# Altium schematic sheet JacdacBrainRP2040 59.SchDoc: complete design
size A3; DocumentNumber: 1; SheetNumber: 1; SheetTotal: 1; VersionControl_RevNumber: 1
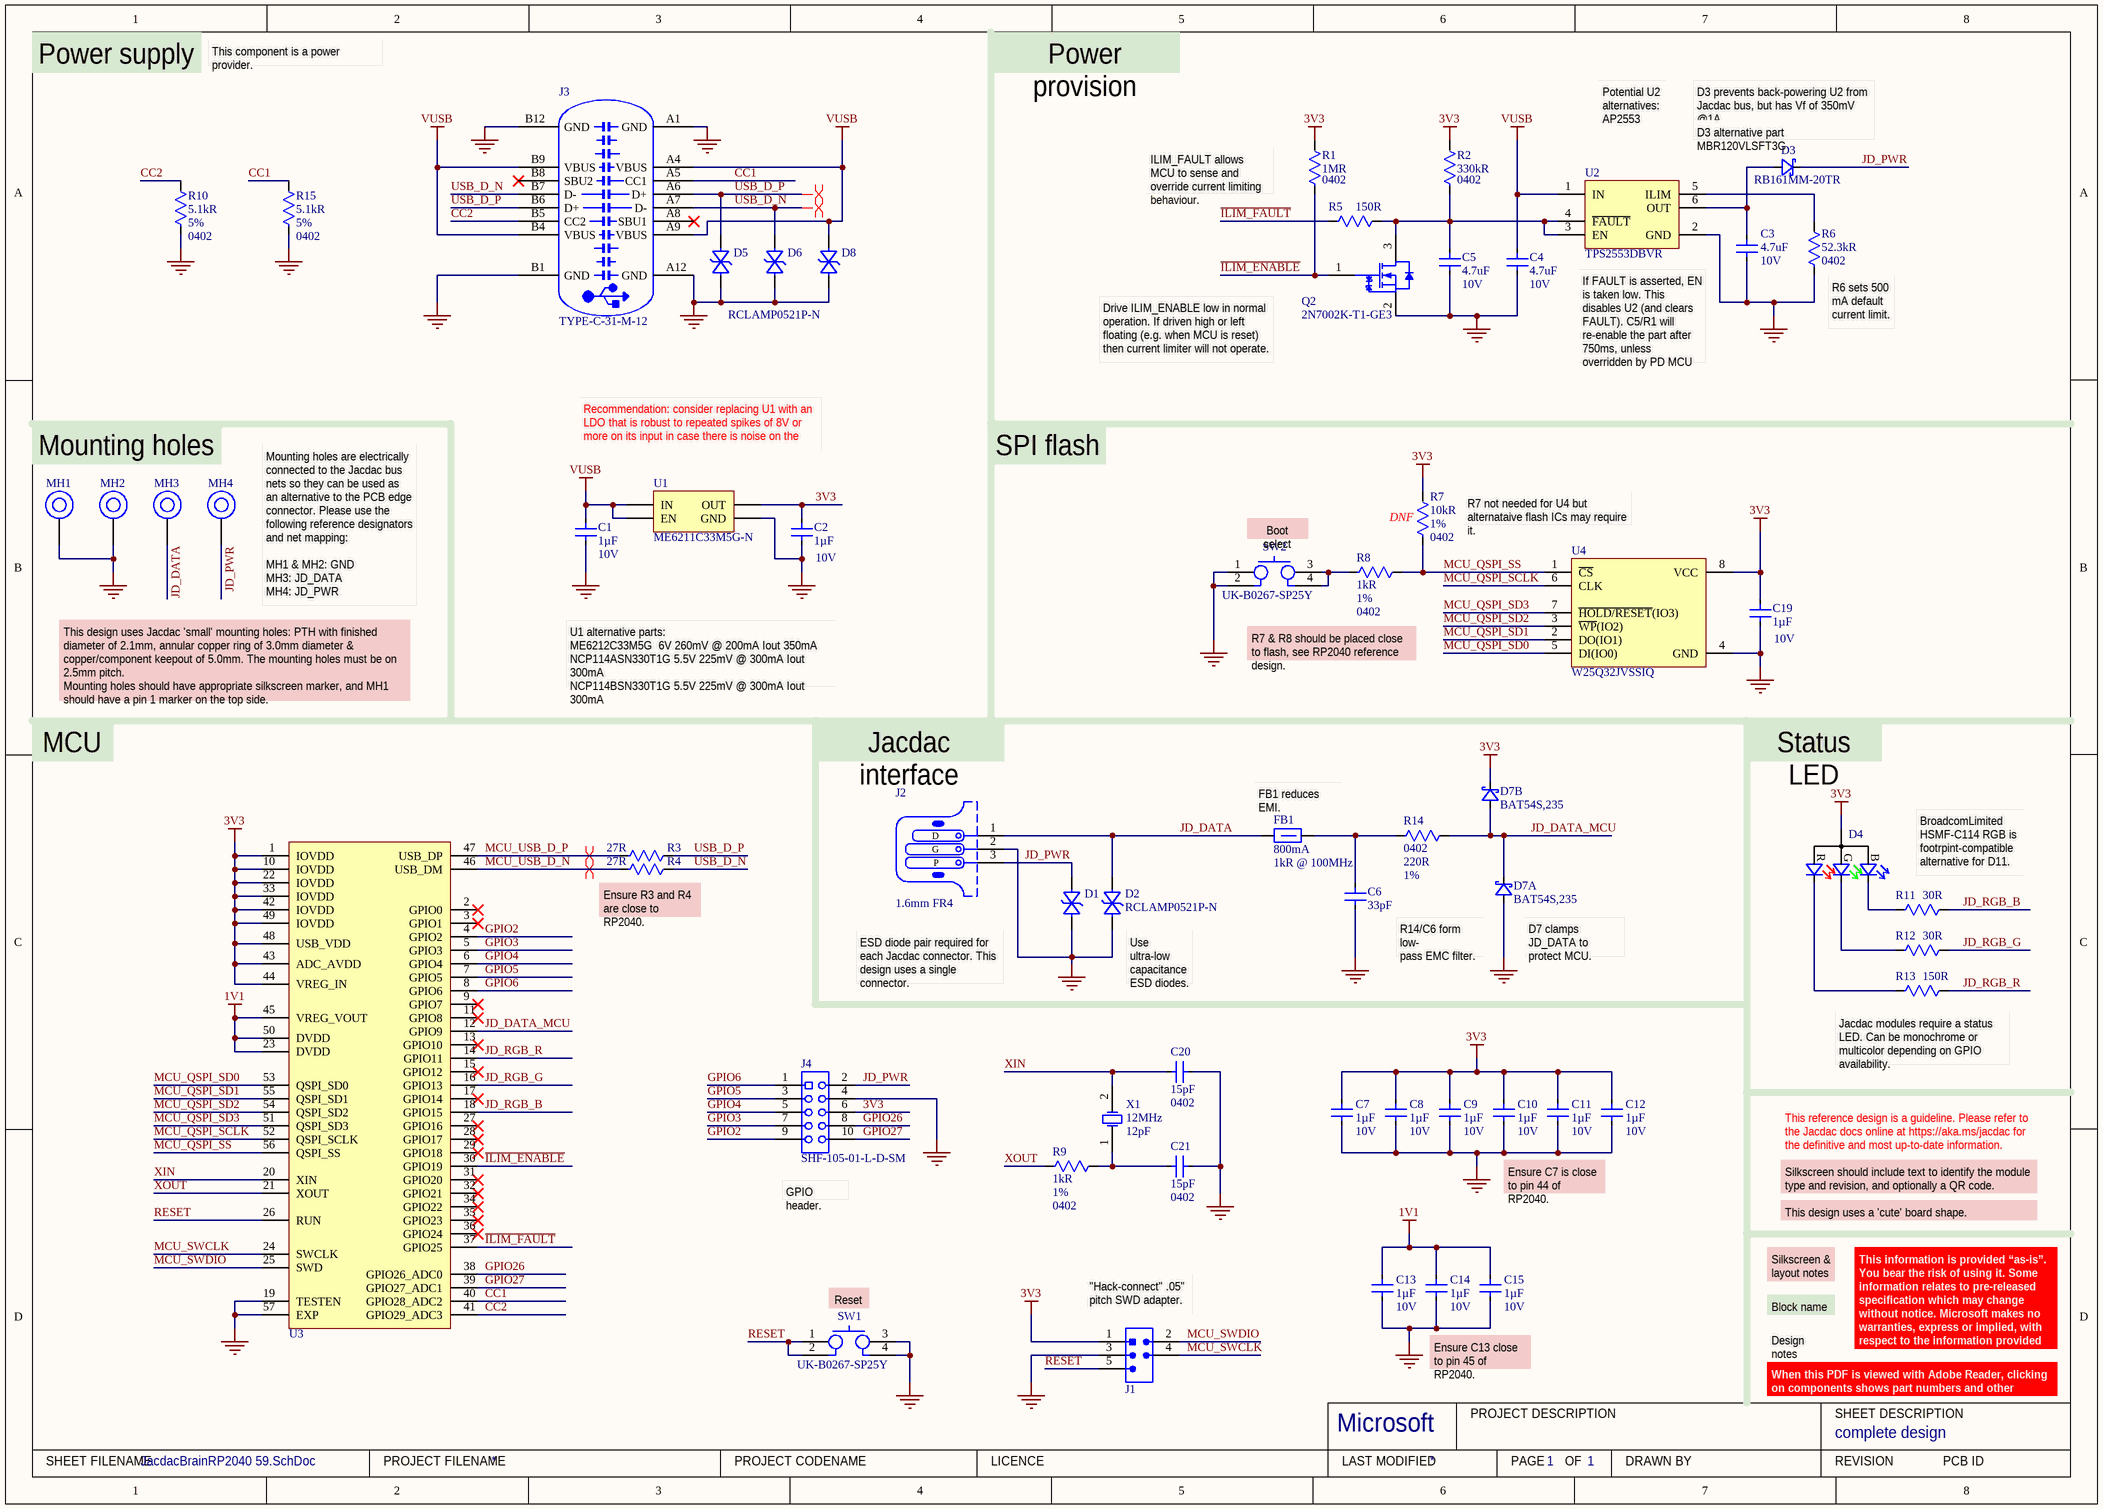
[diagram p0: JacdacBrainRP2040 59.SchDoc]

## Parts
C1  Capacitance: 1µF  Voltage Rating: 10V  [C0402_0.55MM - without outline]  (hidden comment: CL05A105KP5NNNC)
C2  Capacitance: 1µF  Voltage Rating: 10V  [C0402_0.55MM - without outline]  (hidden comment: CL05A105KP5NNNC)
C3  Capacitance: 4.7uF  Voltage Rating: 10V  [R0402 - Without outline]  (hidden comment: CL05A475MP5NRNC)
C4  Capacitance: 4.7uF  Voltage Rating: 10V  [R0402 - Without outline]  (hidden comment: CL05A475MP5NRNC)
C5  Capacitance: 4.7uF  Voltage Rating: 10V  [R0402 - Without outline]  (hidden comment: CL05A475MP5NRNC)
C6  Capacitance: 33pF  [C0402_0.55MM - without outline]  (hidden comment: CL05C330JB51PNC)
C7  Capacitance: 1µF  Voltage Rating: 10V  [C0402_0.55MM - without outline]  (hidden comment: CL05A105KP5NNNC)
C8  Capacitance: 1µF  Voltage Rating: 10V  [C0402_0.55MM - without outline]  (hidden comment: CL05A105KP5NNNC)
C9  Capacitance: 1µF  Voltage Rating: 10V  [C0402_0.55MM - without outline]  (hidden comment: CL05A105KP5NNNC)
C10  Capacitance: 1µF  Voltage Rating: 10V  [C0402_0.55MM - without outline]  (hidden comment: CL05A105KP5NNNC)
C11  Capacitance: 1µF  Voltage Rating: 10V  [C0402_0.55MM - without outline]  (hidden comment: CL05A105KP5NNNC)
C12  Capacitance: 1µF  Voltage Rating: 10V  [C0402_0.55MM - without outline]  (hidden comment: CL05A105KP5NNNC)
C13  Capacitance: 1µF  Voltage Rating: 10V  [C0402_0.55MM - without outline]  (hidden comment: CL05A105KP5NNNC)
C14  Capacitance: 1µF  Voltage Rating: 10V  [C0402_0.55MM - without outline]  (hidden comment: CL05A105KP5NNNC)
C15  Capacitance: 1µF  Voltage Rating: 10V  [C0402_0.55MM - without outline]  (hidden comment: CL05A105KP5NNNC)
C19  Capacitance: 1µF  Voltage Rating: 10V  [C0402_0.55MM - without outline]  (hidden comment: CL05A105KP5NNNC)
C20  Capacitance: 15pF  Case/Package: 0402  [C0402_0.55MM - without outline]  (hidden comment: CL05C150JB5NNNC)
C21  Capacitance: 15pF  Case/Package: 0402  [C0402_0.55MM - without outline]  (hidden comment: CL05C150JB5NNNC)
D1  RCLAMP0521P-N  [TVS 0402 - L]  (value not drawn)
D2  RCLAMP0521P-N  [TVS 0402 - L]
D3  RB161MM-20TR  [SOD-123F]
D4  TZ-P4-1615RGBTCA1-0.55T  [TZ-P4-1615RGBTCA1-0.55T]  (value not drawn)
D5  RCLAMP0521P-N  [TVS 0402 - L]  (value not drawn)
D6  RCLAMP0521P-N  [TVS 0402 - L]  (value not drawn)
D7  Manufacturer Part Number: BAT54S,235  [NXP-BAT54S-TO-236AB - without outline]  (hidden comment: BAT54S)  (parts A,B of 2)
D8  RCLAMP0521P-N  [TVS 0402 - L]
FB1  Current Rating: 800mA  Impedance: 1kR @ 100MHz  [TDK MPZ1608 0.8mm - without outline]  (hidden comment: TDK MPZ1608S102ATA00)
J1  Hack Connect Mini 1.27 mm pitch 2-row  [HACK_CONNECT_MINI_5_X_1_27]  (value not drawn)  (no BOM)
J2  PCB Type: 1.6mm FR4  [JACDAC_EDGE_CONNECTOR_NO_TRACES]  (hidden comment: 3 pin JACDAC edge connector)  (no BOM)
J3  TYPE-C-31-M-12  [TYPE-C-31-M-12]
J4  Manufacturer Part Number: SHF-105-01-L-D-SM  [Samtec SHF-105-01-L-D-SM - NO SILKSCREEN]  (hidden comment: SHF-105-01-L-D-SM-whitesch)
MH1  MH_5.0MMK_3.0MMC_2.1MMD_PTH  [MH_5.0MMK_3.0MMC_2.1MMD_PTH]  (value not drawn)  (no BOM)
MH2  MH_5.0MMK_3.0MMC_2.1MMD_PTH  [MH_5.0MMK_3.0MMC_2.1MMD_PTH]  (value not drawn)  (no BOM)
MH3  MH_5.0MMK_3.0MMC_2.1MMD_PTH  [MH_5.0MMK_3.0MMC_2.1MMD_PTH]  (value not drawn)  (no BOM)
MH4  MH_5.0MMK_3.0MMC_2.1MMD_PTH  [MH_5.0MMK_3.0MMC_2.1MMD_PTH]  (value not drawn)  (no BOM)
Q2  2N7002K-T1-GE3  [SOT-23-3 (TO-236)]
R1  Resistance: 1MR  Case Code (Imperial): 0402  [R0402 - Without outline]
R2  Resistance: 330kR  Size Code: 0402  [R0402 - Without outline]  (hidden comment: RC0402FR-07330KL)
R3  Resistance: 27R  [R0402 - Without outline]  (hidden comment: RC0402FR-0727RL)
R4  Resistance: 27R  [R0402 - Without outline]  (hidden comment: RC0402FR-0727RL)
R5  Resistance: 150R  [R0402 - Without outline]  (hidden comment: RC0402FR-07150RL)
R6  Resistance: 52.3kR  Case Code (Imperial): 0402  [R0402 - Without outline]  (hidden comment: RC0402FR-0752K3L)
R7  Resistance: 10kR  Tolerance: 1%  Case Code (Imperial): 0402  [R0402 - Without outline]  (hidden comment: 10k)
R8  Resistance: 1kR  Tolerance: 1%  Case Code (Imperial): 0402  [R0402 - Without outline]  (hidden comment: RC0402FR-071KL)
R9  Resistance: 1kR  Tolerance: 1%  Case Code (Imperial): 0402  [R0402 - Without outline]  (hidden comment: RC0402FR-071KL)
R10  Resistance: 5.1kR  Tolerance: 5%  Case Code (Imperial): 0402  [R0402 - Without outline]  (hidden comment: RC0402JR-075K1L)
R11  Resistance: 30R  [R0402 - Without outline]  (hidden comment: RC0402FR-0730RL)
R12  Resistance: 30R  [R0402 - Without outline]  (hidden comment: RC0402FR-0730RL)
R13  Resistance: 150R  [R0402 - Without outline]  (hidden comment: RC0402FR-07150RL)
R14  Case Code (Imperial): 0402  Resistance: 220R  Tolerance: 1%  [R0402 - Without outline]  (hidden comment: RC0402FR-07220RL)
R15  Resistance: 5.1kR  Tolerance: 5%  Case Code (Imperial): 0402  [R0402 - Without outline]  (hidden comment: RC0402JR-075K1L)
SW1  UK-B0267-SP25Y  [USAKRO-UK-B0267-SP25Y]
SW2  UK-B0267-SP25Y  [USAKRO-UK-B0267-SP25Y]
U1  ME6211C33M5G-N  [MICRONE-SOT23-5]
U2  TPS2553DBVR  [TI-TPS2553 - without_outline]
U3  RP2040  [RP2040]  (value not drawn)
U4  (no value)  [8-SOIC]
X1  12MHz  Load Capacitance: 12pF  [SMD-5032_2P]

## Nets
1V1: C13.2 C14.2 C15.2 U3.23(DVDD) U3.45(VREG_VOUT) U3.50(DVDD)
3V3: C2.2 C7.2 C8.2 C9.2 C10.2 C11.2 C12.2 C19.2 D4.1(A) D7.2(K) J1.1(VCC) J4.6 R1.1 R2.1 R7.1 U1.5(OUT) U3.1(IOVDD) U3.10(IOVDD) U3.22(IOVDD) U3.33(IOVDD) U3.42(IOVDD) U3.43(ADC_AVDD) U3.44(VREG_IN) U3.48(USB_VDD) U3.49(IOVDD) U4.8(VCC)
GND: C1.1 C2.1 C3.1 C4.1 C5.1 C6.1 C7.1 C8.1 C9.1 C10.1 C11.1 C12.1 C13.1 C14.1 C15.1 C19.1 C20.2 C21.2 D1.2(A) D2.2(A) D5.2(A) D6.2(A) D7.1(A) D8.2(A) J1.3(GND) J2.2(G) J3.A1(GND) J3.A12(GND) J3.B1(GND) J3.B12(GND) J4.4 MH1.1 MH2.1 Q2.2(S) R6.1 R10.2 R15.2 SW1.3 SW1.4 SW2.1 SW2.2 U1.2(GND) U2.2(GND) U3.19(TESTEN) U3.57(EXP) U4.4(GND)
VUSB: C1.2 C4.2 D8.1(K) J3.A4(VBUS) J3.A9(VBUS) J3.B4(VBUS) J3.B9(VBUS) U1.1(IN) U1.3(EN) U2.1(IN)
~{ILIM_ENABLE}: Q2.1(G) R1.2 U3.30(GPIO19)
~{ILIM_FAULT}: R5.1 U3.37(GPIO25)
CC1: J3.A5(CC1) R15.1 U3.40(GPIO28_ADC2)
CC2: J3.B5(CC2) R10.1 U3.41(GPIO29_ADC3)
GPIO2: J4.9 U3.4(GPIO2)
GPIO3: J4.7 U3.5(GPIO3)
GPIO4: J4.5 U3.6(GPIO4)
GPIO5: J4.3 U3.7(GPIO5)
GPIO6: J4.1 U3.8(GPIO6)
GPIO26: J4.8 U3.38(GPIO26_ADC0)
GPIO27: J4.10 U3.39(GPIO27_ADC1)
JD_DATA: D2.1(K) FB1.1 J2.1(D) MH3.1
JD_DATA_MCU: D7.3(K) R14.1 U3.12(GPIO9)
JD_PWR: D1.1(K) D3.1(K) J2.3(P) J4.2 MH4.1
JD_RGB_B: R11.2 U3.18(GPIO15)
JD_RGB_G: R12.2 U3.16(GPIO13)
JD_RGB_R: R13.2 U3.14(GPIO11)
MCU_QSPI_SCLK: U3.52(QSPI_SCLK) U4.6(CLK)
MCU_QSPI_SD0: U3.53(QSPI_SD0) U4.5(DI(IO0))
MCU_QSPI_SD1: U3.55(QSPI_SD1) U4.2(DO(IO1))
MCU_QSPI_SD2: U3.54(QSPI_SD2) U4.3(~{WP}(IO2))
MCU_QSPI_SD3: U3.51(QSPI_SD3) U4.7(~{HOLD/RESET}(IO3))
MCU_QSPI_SS: R7.2 R8.1 U3.56(QSPI_SS) U4.1(~{CS})
MCU_SWCLK: J1.4(SWCLK) U3.24(SWCLK)
MCU_SWDIO: J1.2(SWDIO) U3.25(SWD)
MCU_USB_D_N: R4.1 U3.46(USB_DM)
MCU_USB_D_P: R3.1 U3.47(USB_DP)
RESET: J1.5(RESET) SW1.1 SW1.2 U3.26(RUN)
USB_D_N: D6.1(K) J3.A7(D-) J3.B7(D-) R4.2
USB_D_P: D5.1(K) J3.A6(D+) J3.B6(D+) R3.2
XIN: C20.1 U3.20(XIN) X1.2(OSC2/OSC1)
XOUT: R9.2 U3.21(XOUT)
NetC3_2: C3.2 D3.2(A) U2.6(OUT)
NetC5_2: C5.2 Q2.3(D) R2.2 R5.2 U2.3(EN) U2.4(~{FAULT})
NetC6_2: C6.2 FB1.2 R14.2
NetC21_1: C21.1 R9.1 X1.1(OSC1/OSC2)
NetD4_2: D4.2(R) R13.1
NetD4_3: D4.3(G) R12.1
NetD4_4: D4.4(B) R11.1
NetR6_2: R6.2 U2.5(ILIM)
NetR8_2: R8.2 SW2.3 SW2.4

Not connected (* = marked no-connect by the designer): J3 A8(SBU1)* B8(SBU2)*; U3 2(GPIO0)* 3(GPIO1)* 9(GPIO7)* 11(GPIO8)* 13(GPIO10)* 15(GPIO12)* 17(GPIO14)* 27(GPIO16)* 28(GPIO17)* 29(GPIO18)* 31(GPIO20)* 32(GPIO21)* 34(GPIO22)* 35(GPIO23)* 36(GPIO24)*

## Layout directives
differential pair: MCU_USB_D_N, MCU_USB_D_P, USB_D_N, USB_D_P

## Notes on the sheet
- Power supply
- This component is a power provider.
- Power provision
- Potential U2 alternatives:
  AP2553
- (near D3) D3 prevents back-powering U2 from Jacdac bus, but has Vf of 350mV @1A.
- (near D3) D3 alternative part MBR120VLSFT3G
- (near R1) ILIM_FAULT allows MCU to sense and override current limiting behaviour.
- Drive ILIM_ENABLE low in normal operation. If driven high or left floating (e.g. when MCU is reset) then current limiter will not operate.
- If FAULT is asserted, EN is taken low. This disables U2 (and clears FAULT). C5/R1 will re-enable the part after 750ms, unless overridden by PD MCU
- (near R6) R6 sets 500 mA default current limit.
- Recommendation: consider replacing U1 with an LDO that is robust to repeated spikes of 8V or more on its input in case there is noise on the Jacdac bus.
- Mounting holes
- SPI flash
- (near MH4) Mounting holes are electrically connected to the Jacdac bus nets so they can be used as an alternative to the PCB edge connector. Please use the following reference designators and net mapping:
- (near SW2) Boot select
- (near R7) DNF
- R7 not needed for U4 but alternataive flash ICs may require it.
- (near MH4) MH1 & MH2: GND
  MH3: JD_DATA
  MH4: JD_PWR
- This design uses Jacdac 'small' mounting holes: PTH with finished diameter of 2.1mm, annular copper ring of 3.0mm diameter & copper/component keepout of 5.0mm. The mounting holes must be on 2.5mm pitch.
  Mounting holes should have appropriate silkscreen marker, and MH1 should have a pin 1 marker on the top side.
- U1 alternative parts:
  ME6212C33M5G  6V 260mV @ 200mA Iout 350mA
  NCP114ASN330T1G 5.5V 225mV @ 300mA Iout 300mA
  NCP114BSN330T1G 5.5V 225mV @ 300mA Iout 300mA
- R7 & R8 should be placed close to flash, see RP2040 reference design.
- MCU
- Jacdac interface
- Status LED
- (near FB1) FB1 reduces EMI.
- (near R4) Ensure R3 and R4 are close to RP2040.
- BroadcomLimited HSMF-C114 RGB is footrpint-compatible alternative for D11.
- ESD diode pair required for each Jacdac connector. This design uses a single connector.
- (near D2) Use ultra-low capacitance ESD diodes.
- R14/C6 form low-
  pass EMC filter.
- (near D7) D7 clamps JD_DATA to protect MCU.
- (near R13) Jacdac modules require a status LED. Can be monochrome or multicolor depending on GPIO availability.
- Ensure C7 is close to pin 44 of RP2040.
- Silkscreen should include text to identify the module type and revision, and optionally a QR code.
- This reference design is a guideline. Please refer to the Jacdac docs online at https://aka.ms/jacdac for the definitive and most up-to-date information.
- (near J4) GPIO header.
- This design uses a 'cute' board shape.
- (near SW1) Reset
- (near J1) "Hack-connect" .05" pitch SWD adapter.
- Block name
- Silkscreen & layout notes
- Ensure C13 close to pin 45 of RP2040.
- Design notes
- When this PDF is viewed with Adobe Reader, clicking on components shows part numbers and other details.
- This information is provided “as-is”. You bear the risk of using it. Some information relates to pre-released specification which may change without notice. Microsoft makes no warranties, express or implied, with respect to the information provided here.
- Microsoft
- PROJECT DESCRIPTION
- SHEET DESCRIPTION
- SHEET FILENAME
- PROJECT FILENAME
- PROJECT CODENAME
- LICENCE
- LAST MODIFIED
- PAGE
- OF
- DRAWN BY
- REVISION
- PCB ID

## Library data of the parts
C1 C2 C7-C15 C19 = CL05A105KP5NNNC: CAP CER 1UF 10V X5R 0402; Manufacturer: Samsung; Material: Ceramic; Tolerance: 10%; Supplier 1: Digi-Key; Manufacturer Part Number: CL05A105KP5NNNC; RoHS: Yes; Category: Capacitors; Stock 1: 5705569; Pricing 1: 1=0.10000, 10=0.03900, 50=0.02100, 100=0.01720, 500=0.01228, 1000=0.00965, 2500=0.00877, 5000=0.00807 (USD); Mount: Surface Mount; Case/Package: 0402; Case Code (Metric): 1005; Contact Plating: Tin; Min Operating Temperature: -55°C; Max Operating Temperature: 85°C; Dielectric: X5R; Package Quantity: 1; Packaging: Tape and Reel; Length: 1mm; Height: 0.5mm; Width: 0.02inch; Thickness: 0.022inch; Depth: 0.5mm; Radiation Hardening: No; ComponentLink1URL: https://datasheet.ciiva.com/15195/getdatasheetpartid-358390-15195630.pdf; ComponentLink1Description: Online datasheet; Supplier 2: Mouser; Stock 2: 928941; Pricing 2: 1=0.10000, 10=0.04200, 100=0.01800, 500=0.01300, 1000=0.01000, 2500=0.00900 (USD); Supplier 3: Farnell; Stock 3: 53670; Pricing 3: 10=0.02450, 100=0.02000, 500=0.01310, 2500=0.00920, 5000=0.00810, 10000=0.00640, 50000=0.00490 (GBP); Supplier Part Number 3: 3013329; Supplier Part Number 2: 187-CL05A105KP5NNNC; Supplier Part Number 1: 1276-1076-1-ND; Created: DG; Checked: ?; Case Code (Imperial): 0402
C3-C5 = CL05A475MP5NRNC: CAP CER 4.7UF 10V X5R 0402; Manufacturer: Samsung; Tolerance: 20%; Supplier 1: Digi-Key; Manufacturer Part Number: CL05A475MP5NRNC; RoHS: Yes; Category: Ceramic Capacitors; Stock 1: 840000; Pricing 1: 10000=0.01405, 20000=0.01338 (USD); Mount: Surface Mount; Case/Package: 0402; Case Code (Metric): 1005; Min Operating Temperature: -55°C; Max Operating Temperature: 85°C; Package Quantity: 10000; Packaging: Tape and Reel; Dielectric: X5R; Series: CL; Length: 0.039inch; Width: 0.02inch; Thickness: 0.022inch; Lead Free: Lead Free; RoHS Compliant: Yes; ComponentLink1URL: https://datasheet.ciiva.com/25786/cl05a475mp5nrnc-25786963.pdf; ComponentLink1Description: Online datasheet; Supplier 2: Future Electronics; Stock 2: 2004; Pricing 2: 1=0.23500, 500=0.03970, 1500=0.02900, 2500=0.02500, 5000=0.02050 (USD); Created By: D. Gakure; Checked By: ?; Supplier Part Number 2: 2103694; Supplier Part Number 1: 1276-1482-2-ND; Case Code (Imperial): 0402
C6 = CL05C330JB51PNC: CAP CER 33PF 50V NP0 0402; Manufacturer: Samsung; Tolerance: 5%; Supplier 1: Digi-Key; Manufacturer Part Number: CL05C330JB51PNC; RoHS: Yes; Category: Capacitors; Stock 1: 250654; Pricing 1: 1=0.10000, 10=0.07500, 50=0.04060, 100=0.03320, 500=0.02374, 1000=0.01865, 2500=0.01696, 5000=0.01560 (USD); Mount: Surface Mount; Case/Package: 0402; Case Code (Metric): 1005; Min Operating Temperature: -55°C; Max Operating Temperature: 125°C; Packaging: Tape and Reel; Length: 0.039inch; Width: 0.02inch; Thickness: 0.022inch; Ratings: AEC-Q200; Lead Free: Lead Free; ComponentLink1URL: http://www.samsungsem.com/kr/support/library/product-catalog/mlcc.jsp; ComponentLink1Description: Samsung datasheet online; Supplier 2: Mouser; Stock 2: 97900; Pricing 2: 1=0.11000, 10=0.08200, 100=0.03600, 500=0.02600, 1000=0.02000, 2500=0.01800 (USD); Supplier 3: Future Electronics; Stock 3: 100000; Pricing 3: 10000=0.00780 (USD); Supplier Part Number 3: 6022520; Supplier Part Number 2: 187-CL05C330JB51PNC; Checked: ?; Created: DG; Supplier Part Number 1: 1276-6515-1-ND; Voltage Rating: 50V; Case Code (Imperial): 0402
C20 C21 = CL05C150JB5NNNC: CAP CER 15PF 50V C0G/NP0 0402; Manufacturer: Samsung; Material: Ceramic; Tolerance: 5%; Dielectric: C0G; Temperature Coefficient: 300ppm/°C; Supplier 1: Digi-Key; Manufacturer Part Number: CL05C150JB5NNNC; RoHS: Yes; Category: Ceramic Capacitors; Stock 1: 822355; Pricing 1: 1=0.10000, 10=0.02600, 50=0.01440, 100=0.01180, 500=0.00842, 1000=0.00661, 2500=0.00601, 5000=0.00553 (USD); Mount: Surface Mount; Case Code (Metric): 1005; Contact Plating: Tin; Min Operating Temperature: -55°C; Max Operating Temperature: 125°C; Package Quantity: 1; Packaging: Tape and Reel; Voltage Rating: 50V; Voltage: 50V; Series: CL; Construction: Flat; Length: 1mm; Width: 0.02inch; Height: 0.5mm; Thickness: 0.022inch; Depth: 0.5mm; Radiation Hardening: No; RoHS Compliant: Yes; ComponentLink1URL: https://datasheet.ciiva.com/15195/getdatasheetpartid-497170-15195669.pdf; ComponentLink1Description: Online datasheet; Supplier 2: Mouser; Stock 2: 313617; Pricing 2: 1=0.10000, 10=0.01400, 50=0.01400, 100=0.01200, 1000=0.00700, 10000=0.00500 (USD); Supplier Part Number 2: 187-CL05C150JB5NNNC; Supplier Part Number 1: 1276-1179-1-ND; Case Code (Imperial): 0402
D1 D2 D5 D6 D8 = RCLAMP0521P-N: Bidirectional 5V (Max) 6V 16V 3.5A (8/20us) 0402 TVS RoHS; Manufacturer: Born Semiconductor; Package: 0402; Created By: D Gakure; Checked By: ?; Supplier1: LCSC; Supplier1 Part Number: C316043; ComponentLink1Description: Online datasheet; ComponentLink1URL: https://datasheet.lcsc.com/szlcsc/Bourne-Semicon-Shenzhen-RCLAMP0521P-N_C316043.pdf; Manufacturer Part Number: RCLAMP0521P-N
D3 = RB161MM-20TR: ROHM - RB161MM-20TR - Schottky-Gleichrichterdiode, 20 V, 1 A, Einfach, SOD-123FL, 2 Pin(s), 350 mV; Average Rectified Current: 1A; Max Reverse Voltage (DC): 25V; Supplier 1: Digi-Key; Manufacturer: Rohm; RoHS: Yes; Category: Rectifier Diodes; Pricing 1: 3000=0.09900, 6000=0.09350, 15000=0.08525, 30000=0.07975, 75000=0.07500 (USD); Mount: Surface Mount; Case/Package: SOD; Number of Pins: 2; Max Operating Temperature: 125°C; Packaging: Tape and Reel; RoHS Compliant: Yes; ComponentLink1URL: http://www.mouser.com/ds/2/348/rb161mm-20tr-e-1138856.pdf; ComponentLink1Description: Online datasheet; Supplier 2: RSComponents; Stock 2: 1; Pricing 2: 30=0.29200, 150=0.15800, 300=0.15300, 750=0.14900, 1500=0.14500 (USD); Supplier 3: Mouser; Pricing 3: 1=0.33000, 10=0.25100, 50=0.25100, 100=0.12500, 1000=0.10000, 10000=0.07600 (USD); Supplier Part Number 2: 1246775; Supplier Part Number 1: RB161MM-20TR-ND; Supplier Part Number 3: 755-RB161MM-20TR; Manufacturer Part Number: RB161MM-20TR
D4 = TZ-P4-1615RGBTCA1-0.55T: 1615 Light Emitting Diodes (LED) RoHS; Manufacturer: TUOZHAN; Manufacturer Part Number: TZ-P4-1615RGBTCA1-0.55T; Category: Optoelectronics; Package: 1615; ComponentLink1Description: Online datasheet; ComponentLink1URL: https://datasheet.lcsc.com/szlcsc/2009041238_TUOZHAN-TZ-P4-1615RGBTCA1-0-55T_C779813.pdf; RoHS: RoHS Compliant; Supplier 1: LCSC; Size / Dimension: 1.6x1.5mm; Supplier 1 Part Number: C779813; Packaging: Tape & Reel (TR); Created By: D. Gakure; Checked By: ?
D7 = BAT54S: DIODE ARRAY SCHOTTKY 30V SOT23; Manufacturer: Nexperia; Supplier 1: Digi-Key; RoHS: No; Category: Rectifier Diodes; Stock 1: 14011; Pricing 1: 1=0.13000, 10=0.11900, 100=0.05610, 500=0.03326, 1000=0.02185, 5000=0.02138 (USD); ComponentLink1URL: https://assets.nexperia.com/documents/data-sheet/BAT54_SER.pdf; ComponentLink1Description: NXP datasheet online; Supplier 2: Mouser; Supplier 3: RSComponents; Supplier Part Number 2: 771-BAT54S235; Supplier Part Number 3: 1707990; Supplier Part Number 1: 1727-1868-1-ND
FB1 = TDK MPZ1608S102ATA00: 0603 1k@100MHz 0.8A chip; Core Material: Ferrite; Tolerance: 25%; DC Resistance (DCR): 300mR; Supplier 1: Digi-Key; Stock 1: 113542; Pricing 1: 1=0.1, 10=0.079, 25=0.0716, 50=0.0644, 100=0.0472, 250=0.03432, 500=0.03146, 1000=0.02717 (USD); Mount: Surface Mount; Case/Package: 0603; Case Code (Metric): 1608; Case Code (Imperial): 0603; Package Quantity: 4000; Packaging: Tape and Reel; Max DC Current: 800mA; Length: 0.063inch; Height: 0.037inch; Width: 0.031inch; ComponentLink2URL: https://www.mouser.co.uk/datasheet/2/400/eads_commercial_power_mpz1608_en-923650.pdf; ComponentLink2Description: datasheet online; Supplier 2: Mouser; ComponentLink3Description: datasheet; ComponentLink3URL: Y:\System\Altium\Libraries 2014\TDK\Datasheets\eads_commercial_power_mpz1608_en-923650.pdf; Supplier Part Number 1: 445-8694-1-ND; Supplier Part Number 2: 810-MPZ1608S102ATA00; Manufacturer: TDK; Manufacturer Part Number: MPZ1608S102ATA00
J1 = HACK_CONNECT_MINI
J2 = Jacdac edge connector: 3 pin Jacdac edge connector 1.27mm pitch; Manufacturer Part Number: JACDAC_EDGE_CONNECTOR; Checked By: ?; Created By: D. Gakure; ComponentLink1Description: Yuliang JACDAC cable connector drawing online; ComponentLink1URL: https://github.com/microsoft/jacdac-mdk/blob/main/connector/JACDAC-Connector-by-Yuliang-2020-11-28.pdf; ComponentLink2Description: JACDAC PCB edge connector spec onlin; ComponentLink2URL: https://github.com/microsoft/jacdac-mdk/blob/main/connector/JACDAC_PCB_Edge_Connector_Drawing_JD-PEC-01_rev_01.pdf
J3 = TYPE-C-31-M-12: USB - Type C Female 16 USB Connectors RoHS; Manufacturer: Korean Hroparts Elec; Gender: Receptacle; Number of Positions: 16; RoHS: Yes; Category: USB Connectors; Orientation: Right Angle; ComponentLink1URL: https://datasheet.lcsc.com/szlcsc/1811131825_Korean-Hroparts-Elec-TYPE-C-31-M-12_C165948.pdf; ComponentLink1Description: Online datasheet; Supplier 1 Part Number: C165948; Supplier 1: LCSC; Manufacturer Part Number: TYPE-C-31-M-12
J4 = SHF-105-01-L-D-SM-whitesch: Standard Card Edge Connectors .050 Mini Edge Card Connector, Vertical; Manufacturer: Samtec; Number of Contacts: 10; Gender: Male; Pitch: 1.27mm; Supplier 1: Samtec; Supplier Part Number 1: SHF-105-01-L-D-SM; ComponentLink1Description: samtec datasheet online; ComponentLink1URL: http://www.farnell.com/datasheets/1927736.pdf?src-supplier=Avnet; ComponentLink2Description: samtec datasheet; ComponentLink2URL: Y:\System\Altium\Libraries 2014\Samtec; Supplier 2: Digi-Key; Stock 2: 9740; Pricing 2: 1=2.98, 45=2.618, 135=2.38, 540=2.023, 1035=1.7255, 5040=1.547 (USD); Contact Plating: Gold; Contact Material: Bronze; Housing Color: Black; Housing Material: Polymer; Min Operating Temperature: -55°C; Max Operating Temperature: 125°C; Packaging: Bulk; Number of Rows: 2; Termination: Solder; Orientation: Straight; Length: 12.7mm; Depth: 5.59mm; Radiation Hardening: No; REACH SVHC: No SVHC; Supplier 3: Farnell; Supplier 4: Mouser; Supplier 5: RSComponents; Supplier Part Number 2: SAM10710-ND; Supplier Part Number 3: 1885915; Supplier Part Number 4: 200-SHF10501LDSM; Supplier Part Number 5: 9011854; Supplier 6: Digi-Key; RoHS: Yes; Category: Card Edge Connectors; Stock 6: 49; Pricing 6: 1=4.53000, 10=4.34400, 25=3.98200, 50=3.80100, 100=3.62000, 250=3.16752, 500=3.07700, 1000=2.62450, 2500=2.44350 (USD); Mount: Surface Mount; ComponentLink3URL: https://datasheet.ciiva.com/10926/mecf-10926311.pdf?src-supplier=Avnet; ComponentLink3Description: https://datasheet.ciiva.com/10926/mecf-10926311.pdf?src-supplier=Avnet; ComponentLink4URL: https://datasheet.ciiva.com/16666/mecf-16666423.pdf?src-supplier=Avnet+Europe; ComponentLink4Description: https://datasheet.ciiva.com/16666/mecf-16666423.pdf?src-supplier=Avnet+Europe; Supplier Part Number 6: SAM11496-ND
MH1-MH4 = MH_5.0MMK_3.0MMC_2.1MMD_PTH: Mounting Hole 5.0mm keepout, 3.0mm annualar ring and 2.1mm Drill PTH
Q2 = 2N7002K-T1-GE3: Trans MOSFET N-CH Si 60V 0.3A 3-Pin SOT-23 T/R; Manufacturer: Vishay; Rds On Max: 2R; Input Capacitance: 30pF; Max Power Dissipation: 350mW; Continuous Drain Current (ID): 300mA; Element Configuration: Single; Nominal Vgs: 2V; Number of Elements: 1; Gate to Source Voltage (Vgs): 20V; Turn-Off Delay Time: 35ns; Threshold Voltage: 1V; Turn-On Delay Time: 25ns; Supplier 1: Digi-Key; RoHS: Yes; Category: MOSFETs; Pricing 1: 1=0.27000, 10=0.21800, 25=0.18200, 100=0.11540, 500=0.07590, 1000=0.05161 (USD); Mount: Surface Mount; Case/Package: SOT-23; Number of Pins: 3; Contact Plating: Tin,Matte; Weight: 0.050717oz; Min Operating Temperature: -55°C; Max Operating Temperature: 150°C; Packaging: Tape and Reel; Drain to Source Voltage (Vdss): 60V; On-State Resistance: 2R; Voltage: 60V; Package Quantity: 1; Number of Channels: 1; Drain to Source Breakdown Voltage: 60V; Drain to Source Resistance: 2R; Power Dissipation: 350mW; Length: 3.04mm; Width: 1.4mm; Height: 1.02mm; Radiation Hardening: No; Lead Free: Lead Free; REACH SVHC: Unknown; ComponentLink1URL: https://datasheet.ciiva.com/2957/2n7002k-2957216.pdf; ComponentLink1Description: Online datasheet; Supplier 2: RSComponents; Stock 2: 1; Pricing 2: 100=0.11100 (USD); Supplier Part Number 1: 2N7002K-T1-GE3CT-ND; Supplier Part Number 2: 7879058P; Manufacturer Part Number: 2N7002K-T1-GE3
R1 = RC0402FR-071ML: RES SMD 1M OHM 1% 1/16W 0402; Manufacturer: Yageo; Power Rating: 63mW; Voltage Rating: 50V; Temperature Coefficient: 100ppm/°C; Supplier 1: Digi-Key; Manufacturer Part Number: RC0402FR-071ML; RoHS: Yes; Category: Chip SMD Resistors; Stock 1: 7856490; Pricing 1: 1=0.10000, 10=0.01600, 100=0.00640, 1000=0.00286, 2500=0.00248, 5000=0.00205 (USD); Case/Package: 0402; Case Code (Metric): 1005; Size Code: 0402; Min Operating Temperature: -55°C; Max Operating Temperature: 155°C; Resistor Type: Thick Film; Packaging: Tape and Reel; Termination: SMD/SMT; Features: Moisture Resistant; Series: RC; Max Power Dissipation: 63mW; Number of Terminations: 2; Resistance Tolerance: 1%; Construction: Rectangular; Technology: THICK FILM; Length: 1mm; Height: 0.32mm; Depth: 0.5mm; RoHS Compliant: Yes; REACH SVHC: Unknown; Military Standard: Not; Lead Free: Lead Free; ComponentLink1URL: https://datasheet.ciiva.com/11808/0900766b80c66297-11808125.pdf; ComponentLink1Description: Online datasheet; Supplier 2: Mouser; Stock 2: 1194490; Pricing 2: 1=0.10000, 10=0.01200, 50=0.01200, 100=0.00400, 1000=0.00400, 10000=0.00300 (USD); Supplier 3: Farnell; Stock 3: 1530000; Pricing 3: 10000=0.00290, 50000=0.00200 (GBP); Created By: D. Gakure; Supplier Part Number 2: 603-RC0402FR-071ML; Supplier Part Number 1: 311-1.00MLRCT-ND; Checked By: ?; Supplier Part Number 3: 2421892; Tolerance: 1%
R2 = RC0402FR-07330KL: RES SMD 330K OHM 1% 1/16W 0402; Manufacturer: Yageo; Power Rating: 63mW; Voltage Rating: 50V; Temperature Coefficient: 100ppm/°C; Supplier 1: Digi-Key; Manufacturer Part Number: RC0402FR-07330KL; RoHS: Yes; Category: Chip SMD Resistors; Stock 1: 78809; Pricing 1: 1=0.10000, 10=0.01600, 100=0.00660, 1000=0.00299, 2500=0.00259, 5000=0.00214 (USD); Case/Package: 0402; Case Code (Metric): 1005; Case Code (Imperial): 0402; Min Operating Temperature: -55°C; Max Operating Temperature: 155°C; Package Quantity: 1; Packaging: Tape and Reel; Resistor Type: Thick Film; Number of Terminations: 2; Termination: SMD/SMT; Max Power Dissipation: 63mW; Features: Moisture Resistant; Series: RC; Resistance Tolerance: 1%; Construction: Rectangular; Length: 1mm; Width: 0.02inch; Height: 0.016inch; Depth: 0.5mm; REACH SVHC: Unknown; Military Standard: Not; Lead Free: Lead Free; RoHS Compliant: Yes; ComponentLink1URL: https://datasheet.ciiva.com/2518/pyu-r-int-thick-7-2518994.pdf?src-supplier=Digi-Key; ComponentLink1Description: Online datasheet; Supplier 2: Mouser; Stock 2: 218637; Pricing 2: 1=0.10000, 10=0.01400, 50=0.01400, 100=0.00500, 1000=0.00300, 10000=0.00200 (USD); Supplier 3: Farnell; Stock 3: 310234; Pricing 3: 10=0.01210, 100=0.00460, 500=0.00410, 2500=0.00310, 5000=0.00280, 10000=0.00250, 50000=0.00180 (GBP); Supplier Part Number 2: 603-RC0402FR-07330KL; Supplier Part Number 1: 311-330KLRCT-ND; Supplier Part Number 3: 9239537; Created By: D Gakure; Tolerance: 1%; Checked By: ?
R3 R4 = RC0402FR-0727RL: RES SMD 27 OHM 1% 1/16W 0402; Manufacturer: Yageo; Power Rating: 62.5mW; Voltage Rating: 50V; Temperature Coefficient: 100ppm/°C; Max Power Dissipation: 63mW; Supplier 1: Digi-Key; Manufacturer Part Number: RC0402FR-0727RL; RoHS: Yes; Category: Chip SMD Resistors; Pricing 1: 1=0.10000, 10=0.01600, 100=0.00660, 1000=0.00299, 2500=0.00259, 5000=0.00214 (USD); Case/Package: 0402; Case Code (Metric): 1005; Weight: 2.3E-05oz; Size Code: 0402; Min Operating Temperature: -55°C; Max Operating Temperature: 155°C; Tolerance: 1%; Packaging: Tape and Reel; Resistor Type: Thick Film; Termination: SMD/SMT; Number of Terminations: 2; Features: Moisture Resistant; Series: RC; Construction: Rectangular; Technology: THICK FILM; Resistance Tolerance: 1%; Length: 1mm; Width: 0.5mm; Height: 0.016inch; Depth: 0.5mm; REACH SVHC: Unknown; Military Standard: Not; Lead Free: Lead Free; RoHS Compliant: Yes; ComponentLink1URL: https://datasheet.ciiva.com/11808/0900766b80c66297-11808450.pdf; ComponentLink1Description: Online datasheeet; Supplier 2: Farnell; Stock 2: 29644; Pricing 2: 10=0.01720, 100=0.00650, 500=0.00560, 2500=0.00380, 5000=0.00370, 10000=0.00350, 50000=0.00240 (GBP); Supplier 3: Future Electronics; Stock 3: 450000; Pricing 3: 10000=0.00130, 50000=0.00090, 200000=0.00090, 400000=0.00090, 1000000=0.00080 (USD); Supplier Part Number 3: 2577120; Supplier Part Number 2: 9239049; Supplier Part Number 1: YAG3086CT-ND; Case Code (Imperial): 0402
R5 R13 = RC0402FR-07150RL: RES SMD 150 OHM 1% 1/16W 0402; Manufacturer: Yageo; Power Rating: 62.5mW; Voltage Rating: 50V; Temperature Coefficient: 100ppm/°C; Max Power Dissipation: 63mW; Supplier 1: Digi-Key; Manufacturer Part Number: RC0402FR-07150RL; RoHS: Yes; Category: Chip SMD Resistors; Stock 1: 5214533; Pricing 1: 1=0.10000, 10=0.01400, 100=0.00580, 1000=0.00260, 2500=0.00226, 5000=0.00186 (USD); Case/Package: 0402; Case Code (Metric): 1005; Min Operating Temperature: -55°C; Max Operating Temperature: 155°C; Packaging: Tape and Reel; Package Quantity: 1; Resistor Type: Thick Film; Number of Terminations: 2; Termination: SMD/SMT; Working Voltage: 50V; Features: Moisture Resistant; Series: RC; Resistance Tolerance: 1%; Construction: Rectangular; Technology: THICK FILM; Length: 1mm; Width: 0.02inch; Height: 0.016inch; Depth: 0.5mm; REACH SVHC: No SVHC; Military Standard: Not; Lead Free: Lead Free; RoHS Compliant: Yes; ComponentLink1URL: https://datasheet.ciiva.com/11808/0900766b80c66297-11808422.pdf; ComponentLink1Description: ine datasheet; Supplier 2: Mouser; Stock 2: 582717; Pricing 2: 1=0.10000, 10=0.01200, 50=0.01200, 100=0.00400, 1000=0.00400, 10000=0.00300 (USD); Supplier 3: Farnell; Stock 3: 880000; Pricing 3: 10000=0.00270, 50000=0.00200 (GBP); Created by: D. Gakure; Checked By: ?; Supplier Part Number 3: 2421893; Supplier Part Number 2: 603-RC0402FR-07150RL; Supplier Part Number 1: 311-150LRCT-ND; Tolerance: 1%; Case Code (Imperial): 0402
R6 = RC0402FR-0752K3L: RES SMD 52.3K OHM 1% 1/16W 0402; Manufacturer: Yageo; Temperature Coefficient: 100ppm/°C; Power Rating: 62.5mW; Voltage Rating: 50V; Max Power Dissipation: 63mW; Supplier 1: Digi-Key; Manufacturer Part Number: RC0402FR-0752K3L; RoHS: Yes; Category: Chip SMD Resistors; Stock 1: 1178310; Pricing 1: 1=0.10000, 10=0.01600, 100=0.00640, 1000=0.00286, 2500=0.00248, 5000=0.00205 (USD); Case/Package: 0402; Contact Plating: Tin,Matte; Weight: 2.3E-05oz; Min Operating Temperature: -55°C; Max Operating Temperature: 155°C; Resistor Type: Thick Film; Packaging: Tape and Reel; Number of Terminations: 2; Termination: SMD/SMT; Voltage Rating (DC): 50V; Features: Moisture Resistant; Series: RC; Construction: Rectangular; Length: 1mm; Width: 0.02inch; Height: 0.016inch; Depth: 0.5mm; Military Standard: Not; Lead Free: Lead Free; RoHS Compliant: Yes; ComponentLink1URL: https://datasheet.ciiva.com/16867/pyu-rc0402-51-rohs-l-6-16867930.pdf; ComponentLink1Description: Oline datasheet; Supplier 2: Mouser; Stock 2: 83620; Pricing 2: 1=0.10000, 10=0.01200, 50=0.01200, 100=0.00400, 1000=0.00300, 10000=0.00300 (USD); Created By: D. Gakure; Checked By: ?; Supplier Part Number 2: 603-RC0402FR-0752K3L; Supplier Part Number 1: YAG3179CT-ND; Size Code: 0402; Case Code (Metric): 1005; Tolerance: 1%
R7 = RC0402FR-0710KL: RES SMD 10K OHM 1% 1/16W 0402; Manufacturer: Yageo; Temperature Coefficient: 100ppm/°C; Voltage Rating (DC): 50V; Power Rating: 62.5mW; Supplier 1: Digi-Key; Manufacturer Part Number: RC0402FR-0710KL; RoHS: Yes; Category: Resistors; Stock 1: 40173593; Pricing 1: 1=0.10000, 10=0.01400, 100=0.00580, 1000=0.00262, 2500=0.00228, 5000=0.00188 (USD); Case/Package: 0402; Number of Pins: 2; Case Code (Metric): 1005; Min Operating Temperature: -55°C; Max Operating Temperature: 155°C; Resistor Type: Thick Film; Packaging: Tape and Reel; Voltage Rating: 50V; Termination: SMD/SMT; Working Voltage: 50V; Number of Terminations: 2; Length: 1mm; Height: 0.32mm; Width: 0.5mm; Depth: 0.5mm; Lead Pitch: 0.2mm; REACH SVHC: No SVHC; Lead Free: Lead Free; Military Standard: Not; ComponentLink3URL: https://datasheet.ciiva.com/7849/1686128-7849814.pdf; ComponentLink3Description: Online datasheet; Supplier 2: Mouser; Stock 2: 23672167; Pricing 2: 1=0.10000, 10=0.01300, 100=0.00400, 1000=0.00300, 2500=0.00300, 10000=0.00200 (USD); Supplier 3: Farnell; Stock 3: 370000; Pricing 3: 10000=0.00350 (GBP); Checked: ?; Created: DG; Supplier Part Number 1: 311-10.0KLRCT-ND; Supplier Part Number 2: 603-RC0402FR-0710KL; Supplier Part Number 3: 2363463
R8 R9 = RC0402FR-071KL: RES SMD 1K OHM 1% 1/16W 0402; Manufacturer: Yageo; Temperature Coefficient: 100ppm/°C; Voltage Rating (DC): 50V; Power Rating: 62.5mW; Supplier 1: Digi-Key; Manufacturer Part Number: RC0402FR-071KL; RoHS: Yes; Category: Resistors; Stock 1: 37591306; Pricing 1: 1=0.10000, 10=0.01400, 100=0.00580, 1000=0.00262, 2500=0.00228, 5000=0.00188 (USD); Case/Package: 0402; Number of Pins: 2; Case Code (Metric): 1005; Min Operating Temperature: -55°C; Max Operating Temperature: 155°C; Resistor Type: Thick Film; Packaging: Tape and Reel; Voltage Rating: 50V; Termination: SMD/SMT; Length: 1mm; Height: 0.32mm; Width: 0.5mm; Depth: 0.5mm; REACH SVHC: Unknown; Lead Free: Lead Free; Military Standard: Not; ComponentLink2URL: https://datasheet.ciiva.com/12666/pyu-rc0402-51-rohs-l-6-r-12666741.pdf; ComponentLink2Description: Online datasheet; Supplier 2: Mouser; Stock 2: 11912978; Pricing 2: 1=0.10000, 10=0.01200, 100=0.00400, 1000=0.00400, 2500=0.00400, 10000=0.00300 (USD); Supplier 3: Farnell; Stock 3: 29900; Pricing 3: 1=0.08130, 25=0.01210, 100=0.01120, 250=0.01030, 500=0.00900 (GBP); Supplier Part Number 3: 2132441; Supplier Part Number 2: 603-RC0402FR-071KL; Supplier Part Number 1: 311-1.00KLRDKR-ND; Created: D.G; Checked: ?
R10 R15 = RC0402JR-075K1L: RES SMD 5.1K OHM 5% 1/16W 0402; Manufacturer: Yageo; Voltage Rating: 50V; Power Rating: 62.5mW; Temperature Coefficient: 100ppm/°C; Max Power Dissipation: 63mW; Supplier 1: Digi-Key; Manufacturer Part Number: RC0402JR-075K1L; RoHS: Yes; Category: Chip SMD Resistors; Stock 1: 1270619; Pricing 1: 1=0.10000, 10=0.01300, 100=0.00520, 1000=0.00233, 2500=0.00202, 5000=0.00167 (USD); Case/Package: 0402; Case Code (Metric): 1005; Weight: 2.3E-05oz; Size Code: 0402; Min Operating Temperature: -55°C; Max Operating Temperature: 155°C; Packaging: Tape and Reel; Resistor Type: Thick Film; Termination: SMD/SMT; Voltage Rating (DC): 50V; Features: Moisture Resistant; Series: RC; Number of Terminations: 2; Construction: Rectangular; Resistance Tolerance: 5%; Length: 1mm; Width: 0.5mm; Height: 0.35mm; Depth: 0.5mm; REACH SVHC: No SVHC; Military Standard: Not; Lead Free: Lead Free; RoHS Compliant: Yes; ComponentLink2URL: https://datasheet.ciiva.com/16740/pyu-rc0402-51-rohs-l-6-r-16740925.pdf; ComponentLink2Description: Onnline datasheet; Supplier 2: Newark; Stock 2: 1265; Pricing 2: 1=0.10000, 25=0.01000, 100=0.00400, 250=0.00400, 500=0.00300, 1000=0.00300 (USD); Supplier 3: Mouser; Stock 3: 100817; Pricing 3: 1=0.10000, 10=0.01000, 50=0.01000, 100=0.00400, 1000=0.00300, 10000=0.00200 (USD); Supplier 4: Farnell; Stock 4: 68890; Pricing 4: 10=0.00910, 100=0.00390, 500=0.00320, 2500=0.00240, 5000=0.00210, 10000=0.00190, 50000=0.00150 (GBP); Supplier 5: Farnell; Stock 5: 1265; Pricing 5: 10000=0.00270 (GBP); Supplier Part Number 5: 1799293; Supplier Part Number 4: 3495714; Supplier Part Number 3: 603-RC0402JR-075K1L; Supplier Part Number 2: 68R0016; Supplier Part Number 1: 311-5.1KJRCT-ND; Created By: D. Gakure; Checked By: ?
R11 R12 = RC0402FR-0730RL: RES SMD 30 OHM 1% 1/16W 0402; Manufacturer: Yageo; Temperature Coefficient: 100ppm/°C; Power Rating: 63mW; Voltage Rating: 50V; Supplier 1: Digi-Key; Manufacturer Part Number: RC0402FR-0730RL; RoHS: Yes; Category: Chip SMD Resistors; Stock 1: 2973; Pricing 1: 1=0.10000, 10=0.01400, 100=0.00580, 1000=0.00260, 2500=0.00226, 5000=0.00186 (USD); Case/Package: 0402; Contact Plating: Tin,Matte; Case Code (Metric): 1005; Size Code: 0402; Min Operating Temperature: -55°C; Max Operating Temperature: 155°C; Resistor Type: Thick Film; Packaging: Tape and Reel; Termination: SMD/SMT; Voltage Rating (DC): 50V; Features: Moisture Resistant; Series: RC; Max Power Dissipation: 63mW; Number of Terminations: 2; Construction: Rectangular; Resistance Tolerance: 1%; Length: 1mm; Width: 0.5mm; Height: 0.35mm; Depth: 0.5mm; REACH SVHC: Unknown; Military Standard: Not; Lead Free: Lead Free; RoHS Compliant: Yes; ComponentLink1URL: https://datasheet.ciiva.com/7849/1018594-7849958.pdf; ComponentLink1Description: Online datasheet; Supplier 2: Mouser; Stock 2: 41804; Pricing 2: 1=0.10000, 10=0.01200, 50=0.01200, 100=0.00400, 1000=0.00400, 10000=0.00300 (USD); Supplier 3: Farnell; Stock 3: 4422; Pricing 3: 10=0.01210, 100=0.00420, 500=0.00370, 2500=0.00280, 5000=0.00250, 10000=0.00230, 50000=0.00150 (GBP); Supplier Part Number 3: 1458775; Supplier Part Number 2: 603-RC0402FR-0730RL; Supplier Part Number 1: 311-30LRCT-ND; Created By: D. Gakure; Checked By: ?; Tolerance: 1%; Case Code (Imperial): 0402
R14 = RC0402FR-07220RL: RES SMD 220 OHM 1% 1/16W 0402; Manufacturer: Yageo; Power Rating: 62.5mW; Voltage Rating: 50V; Temperature Coefficient: 100ppm/°C; Max Power Dissipation: 63mW; Supplier 1: Digi-Key; Manufacturer Part Number: RC0402FR-07220RL; RoHS: Yes; Category: Resistors; Stock 1: 1286042; Pricing 1: 1=0.10000, 10=0.01400, 100=0.00580, 1000=0.00262, 2500=0.00228, 5000=0.00188 (USD); Case/Package: 0402; Number of Pins: 2; Case Code (Metric): 1005; Min Operating Temperature: -55°C; Max Operating Temperature: 155°C; Packaging: Tape and Reel; Voltage Rating (DC): 50V; Package Quantity: 1; Termination: SMD/SMT; Resistor Type: Thick Film; Number of Terminations: 2; Features: Moisture Resistant; Length: 1mm; Height: 0.016inch; Width: 0.02inch; Depth: 0.5mm; REACH SVHC: No SVHC; Military Standard: Not; Lead Free: Lead Free; ComponentLink1URL: https://datasheet.ciiva.com/11819/0900766b80c66297-11819466.pdf?src-supplier=RSComponents; ComponentLink1Description: https://datasheet.ciiva.com/11819/0900766b80c66297-11819466.pdf?src-supplier=RSComponents; ComponentLink2URL: https://datasheet.ciiva.com/2453/pyu-r-int-thick-7-2453460.pdf?src-supplier=Digi-Key; ComponentLink2Description: https://datasheet.ciiva.com/2453/pyu-r-int-thick-7-2453460.pdf?src-supplier=Digi-Key; ComponentLink3URL: https://datasheet.ciiva.com/2453/pyu-r-int-thick-7-2453461.pdf?src-supplier=Digi-Key; ComponentLink3Description: https://datasheet.ciiva.com/2453/pyu-r-int-thick-7-2453461.pdf?src-supplier=Digi-Key; ComponentLink4URL: https://datasheet.ciiva.com/2453/pyu-r-int-thick-7-2453462.pdf?src-supplier=Digi-Key; ComponentLink4Description: https://datasheet.ciiva.com/2453/pyu-r-int-thick-7-2453462.pdf?src-supplier=Digi-Key; ComponentLink5URL: https://datasheet.ciiva.com/16746/pyu-rc0402-51-rohs-l-6-r-16746831.pdf?src-supplier=Future+Electronics; ComponentLink5Description: https://datasheet.ciiva.com/16746/pyu-rc0402-51-rohs-l-6-r-16746831.pdf?src-supplier=Future+Electronics; Supplier 2: Mouser; Stock 2: 324625; Pricing 2: 1=0.10000, 10=0.01200, 100=0.00400, 1000=0.00400, 2500=0.00400, 10000=0.00300 (USD); Supplier 3: Farnell; Stock 3: 18234; Pricing 3: 1=0.08130, 25=0.01210, 100=0.01120, 250=0.01030, 500=0.00900 (GBP); Supplier Part Number 3: 2147864; Supplier Part Number 2: 603-RC0402FR-07220RL; Supplier Part Number 1: 311-220LRCT-ND; Created: D.G; Checked: ?
SW1 SW2 = UK-B0267-SP25Y: SWITCH TACTILE SSPST 50mA @ 12VDC; Manufacturer: USAKRO; Operating Force: 3.9 N; Actuator: Oval; Contact Form: SPST; Switch Function: OFF - (ON); Product Category: Tactile Switches; RoHS: Details; Current Rating: 50 mA; Voltage Rating DC: 12 VDC; Mounting Style: SMD/SMT; Supplier 1: LCSC; ComponentLink1URL: https://datasheet.ciiva.com/18514/pts810-4mar13-18514167.pdf; ComponentLink1Description: Online datasheet; Supplier 1 Part Number: C493283; Manufacturer Part Number: UK-B0267-SP25Y
U1 = ME6211C33M5G-N: 6V 260mV @ 200mA(typ) - - Fixed 3.3V SOT-23-5 Linear Voltage Regulators (LDO) ROHS; manufacturer: MICRONE(Nanjing Micro One Elec); Output Current: 500mA; Output Configuration: Positive; Number of Regulators: 1; Max Input Voltage: 6; Dropout Voltage: 200mV; Supplier Part Number: C82942; Category: Voltage Regulators - Linear; Stock 1: 32529; Pricing 1: 1=0.33000, 10=0.24900, 25=0.21760, 100=0.12440, 250=0.11664, 500=0.09330, 1000=0.07153 (USD); Mount: Surface Mount; Case/Package: SOT-23-5; Supplier 1: LCSC; Output Type: Fixed; Min Output Voltage: 3.3V; ComponentLink3URL: https://datasheet.lcsc.com/lcsc/1811131510_MICRONE-Nanjing-Micro-One-Elec-ME6211C33M5G-N_C82942.pdf; ComponentLink3Description: On Semi datasheet online; Created: DG; Checked: ?; Manufacturer Part Number: ME6211C33M5G-N
U2 = TPS2553DBVR: IC PWR SWITCH N-CHAN 1:1 SOT23-6; Manufacturer: Texas Instruments; Number of Outputs: 1; Min Supply Voltage: 2.5V; Max Supply Voltage: 6.5V; On-State Resistance: 85mR; Output Current: 1.5A; Max Power Dissipation: 625mW; Supplier 1: Digi-Key; RoHS: Yes; Category: Hot Swap Controllers; Stock 1: 14713; Pricing 1: 1=1.20000, 10=1.07100, 25=1.01640, 100=0.78050, 250=0.68972, 500=0.65340, 1000=0.50820 (USD); Case/Package: SOT-23; Number of Pins: 6; Weight: 0.00127oz; Min Operating Temperature: -40°C; Max Operating Temperature: 85°C; Packaging: Tape and Reel; Package Quantity: 1; Max Input Voltage: 6.5V; Min Input Voltage: 2.5V; Radiation Hardening: No; Lead Free: Lead Free; REACH SVHC: No SVHC; ComponentLink1URL: https://datasheet.ciiva.com/15108/getdatasheetpartid-297517-15108509.pdf; ComponentLink1Description: Online datasheet; Supplier 2: Farnell; Supplier 3: Mouser; Supplier Part Number 3: 595-TPS2553DBVR; Supplier Part Number 2: 3124082; Supplier Part Number 1: 296-32464-1-ND; Manufacturer Part Number: TPS2553DBVR
U3 = RP2040: QFN-56_7x7 MCU; Manufacturer: Raspberry Pi; Manufacturer Part Number: RP2040; Category: Integrated Circuit; ComponentLink1URL: https://datasheet.lcsc.com/lcsc/2108101830_Raspberry-Pi-RP2040_C2040.pdf; ComponentLink1Description: Online datasheet; Supplier 1: LCSC; Supplier 1 Part Number: C2040
U4 = W25Q32JVSSIQ: FLASH - NOR Memory IC 32Mb (4M x 8) SPI - Quad I/O 133 MHz 8-SOIC; Manufacturer: Winbond; Memory Type: FLASH,NOR; Frequency: 104MHz; Interface: SPI,Serial; Operating Supply Voltage: 3V; Page Size: 256B; Min Supply Voltage: 2.7V; Max Supply Voltage: 3.6V; Supplier 1: Digi-Key; RoHS: Yes; Category: Flash; Stock 1: 139235; Pricing 1: 1=0.89000, 10=0.81400, 25=0.80400, 50=0.79920, 100=0.71460, 250=0.70852, 500=0.69806, 1000=0.67308, 5000=0.61306 (USD); Mount: Surface Mount; Case/Package: SOIC; Number of Pins: 8; Min Operating Temperature: -40°C; Max Operating Temperature: 85°C; Packaging: Tray; Density: 32MB; RoHS Compliant: Yes; Lead Free: Lead Free; ComponentLink1URL: http://www.winbond.com/resource-files/w25q32jv%20revg%2003272018%20plus.pdf; ComponentLink1Description: Online datasheet; Supplier Part Number 1: W25Q32JVSSIQ-ND; Manufacturer Part Number: W25Q32JVSSIQ
X1 = 7A12000053: 12MHz ±30ppm 12pF 50Ω SMD-5032_2P SMD Crystal Resonators RoHS; Manufacturer: TXC; ESR (Equivalent Series Resistance): 50 Ohm; Manufacturer Part Number: 7A12000053; Supplier 1: LCSC; Standard Package: 1; Category: Crystals and Oscillators; Family: Crystals; Frequency: 12MHz; Frequency Tolerance: ±30ppm; Operating Temperature: -40°C ~ 85°C; Mounting Type: Surface Mount; Supplier Part Number 1: C90884; ComponentLink1URL: https://datasheet.lcsc.com/lcsc/1809191817_TXC-Corp-7A12000053_C90884.pdf; ComponentLink1Description: Online datasheet